# Altium schematic sheet CLKB_clocking_system.SchDoc
size A3
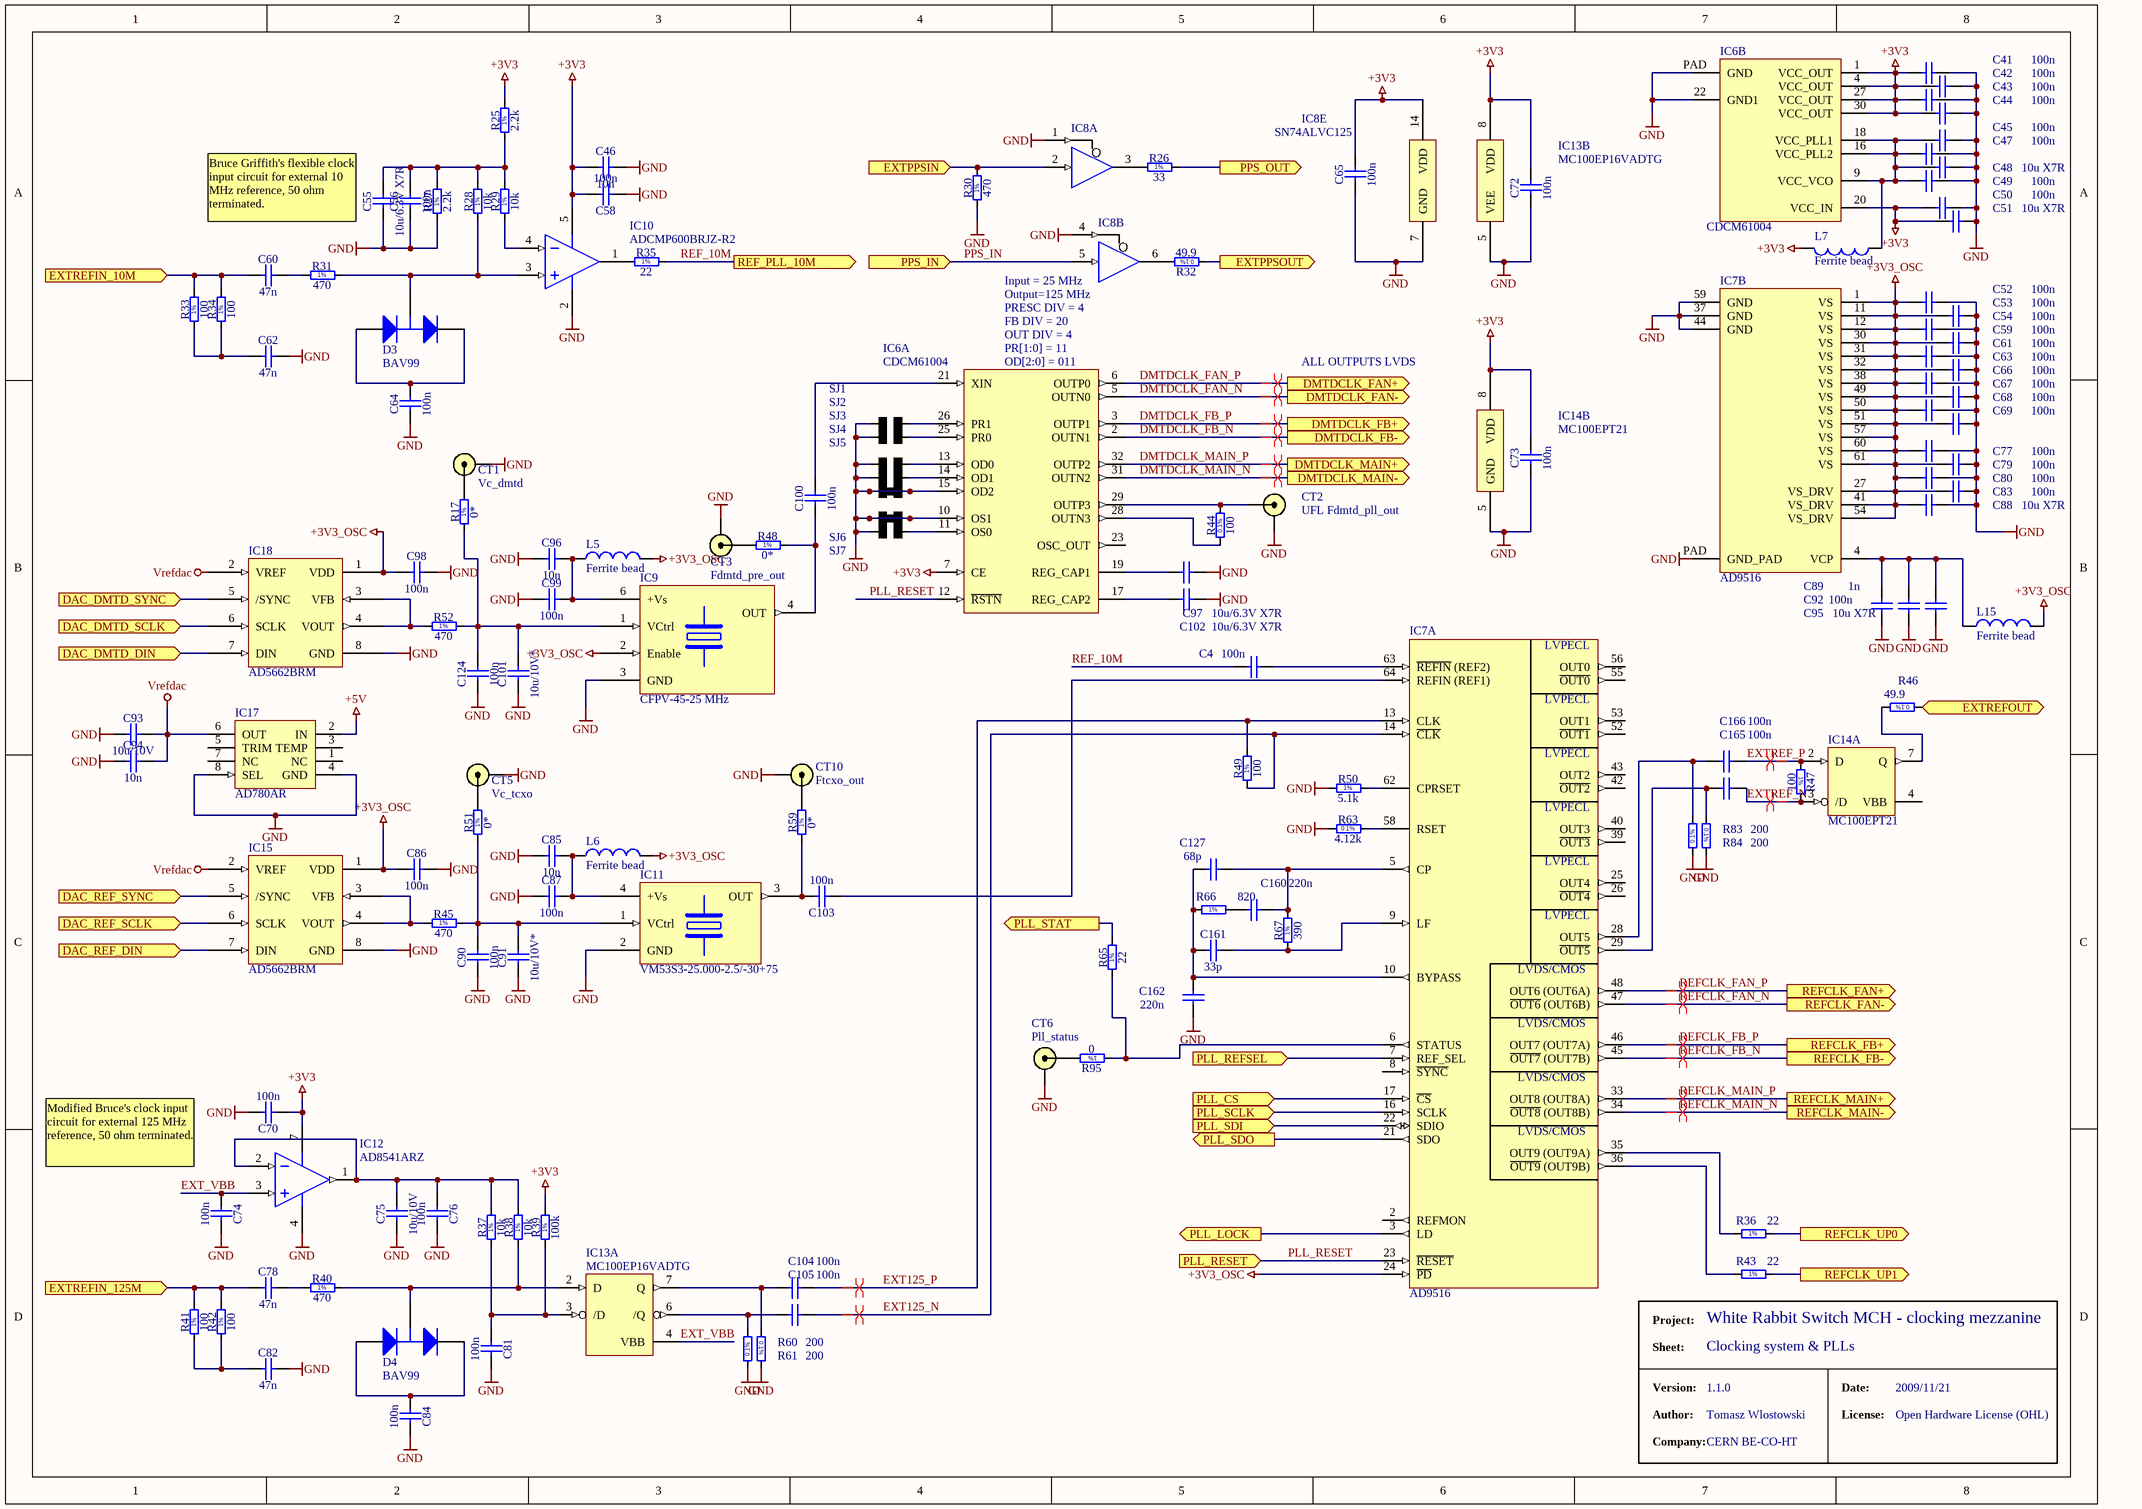
[diagram p0: CLKB_clocking_system.SchDoc]

## Parts
C4  100n  [CAPC1608X87N]
C41  100n  [CAPC1005X55N]
C42  100n  [CAPC1005X55N]
C43  100n  [CAPC1005X55N]
C44  100n  [CAPC1005X55N]
C45  100n  [CAPC1005X55N]
C46  10n  [CAPC1608X87N]
C47  100n  [CAPC1005X55N]
C48  10u X7R  [CAPC1608X87N]
C49  100n  [CAPC1005X55N]
C50  100n  [CAPC1005X55N]
C51  10u X7R  [CAPC1608X87N]
C52  100n  [CAPC1005X55N]
C53  100n  [CAPC1005X55N]
C54  100n  [CAPC1005X55N]
C55  10u/6.3V X7R  [CAPC3216X140N]
C56  100n  [CAPC1608X87N]
C58  100n  [CAPC1608X87N]
C59  100n  [CAPC1005X55N]
C60  47n  [CAPC1608X87N]
C61  100n  [CAPC1005X55N]
C62  47n  [CAPC1608X87N]
C63  100n  [CAPC1005X55N]
C64  100n  [CAPC1608X87N]
C65  100n  [CAPC1608X87N]
C66  100n  [CAPC1005X55N]
C67  100n  [CAPC1005X55N]
C68  100n  [CAPC1005X55N]
C69  100n  [CAPC1005X55N]
C70  100n  [CAPC1608X87N]
C72  100n  [CAPC1608X87N]
C73  100n  [CAPC1608X87N]
C74  100n  [CAPC1608X87N]
C75  10u/10V  [CAPC3216X140N]
C76  100n  [CAPC1608X87N]
C77  100n  [CAPC1005X55N]
C78  47n  [CAPC1608X87N]
C79  100n  [CAPC1005X55N]
C80  100n  [CAPC1005X55N]
C81  100n  [CAPC1608X87N]
C82  47n  [CAPC1608X87N]
C83  100n  [CAPC1005X55N]
C84  100n  [CAPC1608X87N]
C85  10n  [CAPC1608X87N]
C86  100n  [CAPC1608X87N]
C87  100n  [CAPC1608X87N]
C88  10u X7R  [CAPC1608X87N]
C89  1n  [CAPC1005X55N]
C90  100n  [CAPC1608X87N]
C91  10u/10V*  [CAPC3216X140N]
C92  100n  [CAPC1005X55N]
C93  10u/10V  [CAPC3216X140N]
C94  10n  [CAPC1608X87N]
C95  10u X7R  [CAPC1608X87N]
C96  10n  [CAPC1608X87N]
C97  10u/6.3V X7R  [CAPC1608X87N]
C98  100n  [CAPC1608X87N]
C99  100n  [CAPC1608X87N]
C100  100n  [CAPC1608X87N]
C101  10u/10V*  [CAPC3216X140N]
C102  10u/6.3V X7R  [CAPC1608X87N]
C103  100n  [CAPC1608X87N]
C104  100n  [CAPC1005X55N]
C105  100n  [CAPC1005X55N]
C124  100n  [CAPC1608X87N]
C127  68p  [CAPC1608X87N]
C160  220n  [CAPC1608X87N]
C161  33p  [CAPC1608X87N]
C162  220n  [CAPC1608X87N]
C165  100n  [CAPC1005X55N]
C166  100n  [CAPC1005X55N]
CT1  Vc_dmtd  [CON_UFL_HIROSE_RECEPTACLE]
CT2  UFL Fdmtd_pll_out  [CON_UFL_HIROSE_RECEPTACLE]
CT3  Fdmtd_pre_out  [CON_UFL_HIROSE_RECEPTACLE]
CT5  Vc_tcxo  [CON_UFL_HIROSE_RECEPTACLE]
CT6  Pll_status  [CON_UFL_HIROSE_RECEPTACLE]
CT10  Ftcxo_out  [CON_UFL_HIROSE_RECEPTACLE]
D3  BAV99  [SOT-23]
D4  BAV99  [SOT-23]
IC6  CDCM61004  [QFN32_POWERPAD]  (parts A,B of 2)
IC7  AD9516  [QFN50P900X900X100-64M]  (parts A,B of 2)
IC8  SN74ALVC125  [SO-14]  (value not drawn)  (parts A,B,E of 5)
IC9  CFPV-45-25 MHz  [vs-705]
IC10  value ADCMP600BRJZ-R2  [SOT23-5AL]  (hidden comment: ADCMP600)
IC11  VM53S3-25.000-2.5/-30+75  [VCTCXO_VM53S]
IC12  value AD8541ARZ  [SOIC127P600-8AL]  (hidden comment: AD8541)
IC13  value MC100EP16VADTG  [TSOP65P490-8AN]  (hidden comment: MC100EP16)  (parts A,B of 2)
IC14  MC100EPT21  [TSOP65P490-8AN]  (parts A,B of 2)
IC15  value AD5662BRM  [TSOP65P490-8AN]  (hidden comment: AD5662B)
IC17  AD780AR  [R-8C_M]
IC18  value AD5662BRM  [TSOP65P490-8AN]  (hidden comment: AD5662B)
L5  Ferrite bead  [INDC2012-0805]
L6  Ferrite bead  [INDC2012-0805]
L7  Ferrite bead  [INDC1608-0603]
L15  Ferrite bead  [INDC1608-0603]
R17  0*  [RESC1608X55N]
R25  2.2k  [RESC1608X55N]
R26  33  [RESC1608X55N]
R27  2.2k  [RESC1608X55N]
R28  10k  [RESC1608X55N]
R29  10k  [RESC1608X55N]
R30  470  [RESC1608X55N]
R31  470  [RESC1608X55N]
R32  49.9  [RESC1608X55N]
R33  100  [RESC1608X55N]
R34  100  [RESC1608X55N]
R35  22  [RESC1608X55N]
R36  22  [RESC1608X55N]
R37  10k  [RESC1608X55N]
R38  10k  [RESC1608X55N]
R39  100k  [RESC1608X55N]
R40  470  [RESC1608X55N]
R41  100  [RESC1608X55N]
R42  100  [RESC1608X55N]
R43  22  [RESC1608X55N]
R44  100  [RESC1608X55N]
R45  470  [RESC1608X55N]
R46  49.9  [RESC1608X55N]
R47  100  [RESC1608X55N]
R48  0*  [RESC1608X55N]
R49  100  [RESC1608X55N]
R50  5.1k  [RESC1608X55N]
R51  0*  [RESC1608X55N]
R52  470  [RESC1608X55N]
R59  0*  [RESC1608X55N]
R60  200  [RESC1608X55N]
R61  200  [RESC1608X55N]
R63  4.12k  [RESC1608X55N]
R65  22  [RESC1608X55N]
R66  820  [RESC1608X55N]
R67  390  [RESC1608X55N]
R83  200  [RESC1608X55N]
R84  200  [RESC1608X55N]
R95  0  [RESC1608X55N]
SJ1  Solder joint (open)  [SJOINT_norm_open]  (value not drawn)
SJ2  Solder joint (open)  [SJOINT_norm_open]  (value not drawn)
SJ3  Solder joint (open)  [SJOINT_norm_open]  (value not drawn)
SJ4  Solder joint (open)  [SJOINT_norm_open]  (value not drawn)
SJ5  Solder joint (closed)  [SJOINT_norm_short]  (value not drawn)
SJ6  Solder joint (closed)  [SJOINT_norm_short]  (value not drawn)
SJ7  Solder joint (open)  [SJOINT_norm_open]  (value not drawn)

## Ports
DAC_DMTD_DIN (in), DAC_DMTD_SCLK (in), DAC_DMTD_SYNC (in), DAC_REF_DIN (in), DAC_REF_SCLK (in), DAC_REF_SYNC (in), DMTDCLK_FAN+ (out), DMTDCLK_FAN- (out), DMTDCLK_FB+ (out), DMTDCLK_FB- (out), DMTDCLK_MAIN+ (out), DMTDCLK_MAIN- (out), EXTPPSIN (in), EXTPPSOUT (out), EXTREFIN_10M (in), EXTREFIN_125M (in), EXTREFOUT (in), PLL_CS (in), PLL_LOCK (out), PLL_REFSEL (in), PLL_RESET (in), PLL_SCLK (in), PLL_SDI (in), PLL_SDO (out), PLL_STAT (out), PPS_IN (in), PPS_OUT (out), REF_PLL_10M (out), REFCLK_FAN+ (out), REFCLK_FAN- (out), REFCLK_FB+ (out), REFCLK_FB- (out), REFCLK_MAIN+ (out), REFCLK_MAIN- (out), REFCLK_UP0 (out), REFCLK_UP1 (out)

## Nets
+3V3: C41.1 C42.1 C43.1 C44.1 C46.1 C50.1 C51.1 C58.2 C65.2 C70.1 C72.2 C73.2 IC6.1(VCC_OUT) IC6.4(VCC_OUT) IC6.7(CE) IC6.20(VCC_IN) IC6.27(VCC_OUT) IC6.30(VCC_OUT) IC8.14(VDD) IC10.5(VCC/VCCO) IC12.7(V+) IC13.8(VDD) IC14.8(VDD) L7.2 R25.2 R39.2
+3V3_OSC: C52.1 C53.1 C54.1 C59.1 C61.1 C63.1 C66.1 C67.1 C68.1 C69.1 C77.1 C79.1 C80.1 C83.1 C86.1 C88.1 C98.1 IC7.1(VS) IC7.11(VS) IC7.12(VS) IC7.24(~{PD}) IC7.27(VS_DRV) IC7.30(VS) IC7.31(VS) IC7.32(VS) IC7.38(VS) IC7.41(VS_DRV) IC7.49(VS) IC7.50(VS) IC7.51(VS) IC7.54(VS_DRV) IC7.57(VS) IC7.60(VS) IC7.61(VS) IC9.2(Enable) IC15.1(VDD) IC18.1(VDD) L5.2 L6.2 L15.2
+5V: IC17.2(IN)
GND: C41.2 C42.2 C43.2 C44.2 C45.2 C46.2 C47.2 C48.2 C49.2 C50.2 C51.2 C52.2 C53.2 C54.2 C55.1 C56.1 C58.1 C59.2 C61.2 C62.2 C63.2 C64.1 C65.1 C66.2 C67.2 C68.2 C69.2 C70.2 C72.1 C73.1 C74.2 C75.1 C76.2 C77.2 C79.2 C80.2 C81.2 C82.2 C83.2 C84.2 C85.1 C86.2 C87.1 C88.2 C89.1 C90.1 C91.1 C92.1 C93.1 C94.1 C95.1 C96.1 C97.2 C98.2 C99.1 C101.1 C102.2 C124.1 C162.1 CT1.2 CT2.2 CT3.2 CT5.2 CT6.2 CT10.2 IC6.10(OS1) IC6.15(OD2) IC6.22(GND1) IC6.PAD(GND) IC7.37(GND) IC7.44(GND) IC7.59(GND) IC7.PAD(GND_PAD) IC8.1(~{A}) IC8.4(~{A}) IC8.7(GND) IC9.3(GND) IC10.2(VEE) IC11.2(GND) IC12.4(V-) IC13.5(VEE) IC14.5(GND) IC15.8(GND) IC17.4(GND) IC17.8(SEL) IC18.8(GND) R27.1 R30.1 R50.1 R60.2 R61.1 R63.1 R83.2 R84.1 SJ1.1(P1) SJ2.1(P1) SJ3.1(P1) SJ4.1(P1) SJ5.1(P1) SJ5.2(P2) SJ6.1(P1) SJ6.2(P2) SJ7.1(P1)
Vrefdac: C93.2 C94.2 IC15.2(VREF) IC17.6(OUT) IC18.2(VREF)
DAC_DMTD_DIN: IC18.7(DIN) ; port DAC_DMTD_DIN
DAC_DMTD_SCLK: IC18.6(SCLK) ; port DAC_DMTD_SCLK
DAC_DMTD_SYNC: IC18.5(/SYNC) ; port DAC_DMTD_SYNC
DAC_REF_DIN: IC15.7(DIN) ; port DAC_REF_DIN
DAC_REF_SCLK: IC15.6(SCLK) ; port DAC_REF_SCLK
DAC_REF_SYNC: IC15.5(/SYNC) ; port DAC_REF_SYNC
DMTDCLK_FAN_N: IC6.5(OUTN0) ; port DMTDCLK_FAN-
DMTDCLK_FAN_P: IC6.6(OUTP0) ; port DMTDCLK_FAN+
DMTDCLK_FB_N: IC6.2(OUTN1) ; port DMTDCLK_FB-
DMTDCLK_FB_P: IC6.3(OUTP1) ; port DMTDCLK_FB+
DMTDCLK_MAIN_N: IC6.31(OUTN2) ; port DMTDCLK_MAIN-
DMTDCLK_MAIN_P: IC6.32(OUTP2) ; port DMTDCLK_MAIN+
EXT125_N: C105.2 IC7.14(~{CLK}) R49.1
EXT125_P: C104.2 IC7.13(CLK) R49.2
EXT_VBB: C74.1 IC12.3(IN+) IC13.4(VBB)
EXTPPSIN: IC8.2(B) R30.2 ; port EXTPPSIN
EXTPPSOUT: R32.1 ; port EXTPPSOUT
EXTREF_N: C165.2 IC14.3(/D) R47.2
EXTREF_P: C166.2 IC14.2(D) R47.1
EXTREFIN_10M: C60.1 R33.2 R34.2 ; port EXTREFIN_10M
EXTREFIN_125M: C78.1 R41.2 R42.2 ; port EXTREFIN_125M
EXTREFOUT: R46.1 ; port EXTREFOUT
PLL_CS: IC7.17(~{CS}) ; port PLL_CS
PLL_LOCK: IC7.3(LD) ; port PLL_LOCK
PLL_REFSEL: IC7.7(REF_SEL) ; port PLL_REFSEL
PLL_RESET: IC6.12(~{RSTN}) IC7.23(~{RESET}) ; port PLL_RESET
PLL_SCLK: IC7.16(SCLK) ; port PLL_SCLK
PLL_SDI: IC7.22(SDIO) ; port PLL_SDI
PLL_SDO: IC7.21(SDO) ; port PLL_SDO
PLL_STAT: R65.2 ; port PLL_STAT
PPS_IN: IC8.5(B) ; port PPS_IN
PPS_OUT: R26.2 ; port PPS_OUT
REF_10M: C4.2 R35.2 ; port REF_PLL_10M
REFCLK_FAN_N: IC7.47(~{OUT6}_(OUT6B)) ; port REFCLK_FAN-
REFCLK_FAN_P: IC7.48(OUT6_(OUT6A)) ; port REFCLK_FAN+
REFCLK_FB_N: IC7.45(~{OUT7}_(OUT7B)) ; port REFCLK_FB-
REFCLK_FB_P: IC7.46(OUT7_(OUT7A)) ; port REFCLK_FB+
REFCLK_MAIN_N: IC7.34(~{OUT8}_(OUT8B)) ; port REFCLK_MAIN-
REFCLK_MAIN_P: IC7.33(OUT8_(OUT8A)) ; port REFCLK_MAIN+
REFCLK_UP0: R36.2 ; port REFCLK_UP0
REFCLK_UP1: R43.2 ; port REFCLK_UP1
NetC4_1: C4.1 IC7.63(~{REFIN}_(REF2))
NetC45_1: C45.1 C47.1 C48.1 C49.1 IC6.9(VCC_VCO) IC6.16(VCC_PLL2) IC6.18(VCC_PLL1) L7.1
NetC55_2: C55.2 C56.2 R25.1 R27.2 R28.2 R29.2
NetC60_2: C60.2 R31.1
NetC62_1: C62.1 R33.1 R34.1
NetC64_2: C64.2 D3.1(A) D3.2(K)
NetC75_2: C75.2 C76.1 IC12.1(OUT) IC12.2(IN-) R37.2 R38.2
NetC78_2: C78.2 R40.1
NetC81_1: C81.1 IC13.3(/D) R37.1 R39.1
NetC82_1: C82.1 R41.1 R42.1
NetC84_1: C84.1 D4.1(A) D4.2(K)
NetC85_2: C85.2 C87.2 IC11.4(+Vs) L6.1
NetC89_2: C89.2 C92.2 C95.2 IC7.4(VCP) L15.1
NetC90_2: C90.2 C91.2 IC11.1(VCtrl) R45.2 R51.1
NetC96_2: C96.2 C99.2 IC9.6(+Vs) L5.1
NetC97_1: C97.1 IC6.19(REG_CAP1)
NetC100_1: C100.1 IC9.4(OUT) R48.2
NetC100_2: C100.2 IC6.21(XIN)
NetC101_2: C101.2 C124.2 IC9.1(VCtrl) R17.1 R52.2
NetC102_1: C102.1 IC6.17(REG_CAP2)
NetC103_1: C103.1 IC7.64(REFIN_(REF1))
NetC103_2: C103.2 IC11.3(OUT) R59.1
NetC104_1: C104.1 IC13.7(Q) R60.1
NetC105_1: C105.1 IC13.6(/Q) R61.2
NetC127_1: C127.1 C161.1 C162.2 IC7.10(BYPASS) R66.1
NetC127_2: C127.2 C160.2 IC7.5(CP) R67.2
NetC160_1: C160.1 R66.2
NetC161_2: C161.2 IC7.9(LF) R67.1
NetC165_1: C165.1 IC7.29(~{OUT5}) R83.1
NetC166_1: C166.1 IC7.28(OUT5) R84.2
NetCT1_1: CT1.1 R17.2
NetCT2_1: CT2.1 IC6.29(OUTP3) R44.2
NetCT3_1: CT3.1 R48.1
NetCT5_1: CT5.1 R51.2
NetCT6_1: CT6.1 R95.2
NetCT10_1: CT10.1 R59.2
NetD3_3: D3.3(C) IC10.3(VP) R28.1 R31.2
NetD4_3: D4.3(C) IC13.2(D) R38.1 R40.2
NetIC6_11: IC6.11(OS0) SJ7.2(P2)
NetIC6_13: IC6.13(OD0) SJ3.2(P2)
NetIC6_14: IC6.14(OD1) SJ4.2(P2)
NetIC6_25: IC6.25(PR0) SJ2.2(P2)
NetIC6_26: IC6.26(PR1) SJ1.2(P2)
NetIC6_28: IC6.28(OUTN3) R44.1
NetIC7_6: IC7.6(STATUS) R65.1 R95.1
NetIC7_35: IC7.35(OUT9_(OUT9A)) R36.1
NetIC7_36: IC7.36(~{OUT9}_(OUT9B)) R43.1
NetIC7_58: IC7.58(RSET) R63.2
NetIC7_62: IC7.62(CPRSET) R50.2
NetIC8_3: IC8.3(Y) R26.1
NetIC8_6: IC8.6(Y) R32.2
NetIC10_1: IC10.1(Q) R35.1
NetIC10_4: IC10.4(VN) R29.1
NetIC14_7: IC14.7(Q) R46.2
NetIC15_3: IC15.3(VFB) IC15.4(VOUT) R45.1
NetIC18_3: IC18.3(VFB) IC18.4(VOUT) R52.1

Not connected (* = marked no-connect by the designer): IC6 23(OSC_OUT); IC7 2(REFMON) 8(~{SYNC}) 25(OUT4) 26(~{OUT4}) 39(~{OUT3}) 40(OUT3) 42(~{OUT2}) 43(OUT2) 52(~{OUT1}) 53(OUT1) 55(~{OUT0}) 56(OUT0); IC14 4(VBB); IC17 1(NC) 3(TEMP) 5(TRIM) 7(NC)

## Layout directives
differential pair: DMTDCLK_FAN_N, DMTDCLK_FAN_P, DMTDCLK_FB_N, DMTDCLK_FB_P, DMTDCLK_MAIN_N, DMTDCLK_MAIN_P, EXT125_N, EXT125_P, EXTREF_N, EXTREF_P, REFCLK_FAN_N, REFCLK_FAN_P, REFCLK_FB_N, REFCLK_FB_P, REFCLK_MAIN_N, REFCLK_MAIN_P

## Notes on the sheet
- (near C55) Bruce Griffith's flexible clock input circuit for external 10 MHz reference, 50 ohm terminated.
- (near IC8) Output=125 MHz
- (near IC8) Input = 25 MHz
- PRESC DIV = 4
- FB DIV = 20
- (near IC6) OUT DIV = 4
- (near IC6) PR[1:0] = 11
- (near IC6) OD[2:0] = 011
- ALL OUTPUTS LVDS
- Modified Bruce's clock input circuit for external 125 MHz reference, 50 ohm terminated.
- Project:
- (near R43) White Rabbit Switch MCH - clocking mezzanine
- Sheet:
- Version:
- Clocking system & PLLs
- 1.1.0
- Date:
- 2009/11/21
- Author:
- Company:
- Tomasz Wlostowski
- CERN BE-CO-HT
- License:
- Open Hardware License (OHL)
- (in symbol AD9516, part A) LVPECL; LVDS/CMOS
- (in symbol R0603_0R_JUMPER) 1%
- (in symbol R0603_2K2_1%_0.1W_100PPM) 1%
- (in symbol R0603_4K12_0.1%_0.063W_10PPM) 0.1%
- (in symbol R0603_5K1_1%_0.1W_100PPM) 1%
- (in symbol R0603_10K_1%_0.1W_100PPM) 1%
- (in symbol R0603_22R_1%_0.1W_100PPM) 1%
- (in symbol R0603_33R_1%_0.1W_100PPM) 1%
- (in symbol R0603_49R9_0.1%_0.063W_10PPM) 0.1%
- (in symbol R0603_100K_1%_0.1W_100PPM) 1%
- (in symbol R0603_100R_0.1%_0.063W_10PPM) 0.1%
- (in symbol R0603_100R_1%_0.1W_100PPM) 1%
- (in symbol R0603_200R_0.1%_0.063W_10PPM) 0.1%
- (in symbol R0603_390R_1%_0.1W_100PPM) 1%
- (in symbol R0603_470R_1%_0.1W_100PPM) 1%
- (in symbol R0603_820R_1%_0.1W_100PPM) 1%

## Library data of the parts
C4 C56 C58 C64 C65 C70 C72-C74 C76 C81 C84 C86 C87 C90 C98-C100 C103 C124 = CC0603_100NF_50V_10%_X7R: Non-polarised capacitor; Part Description: SMD Multilayer Chip Ceramic Capacitor; Manufacturer: GENERIC; Manufacturer1 Part Number: 223858615649; Manufacturer1 Datasheet: \\cern.ch\dfs\Applications\Altium\Datasheets\CC0603_X7R_PHYCOMP.pdf; Value: 100nF; Voltage: 50V; TC: X7R; Tolerance: ±10%; Table: Capacitors SMD; Part Number: CC0603_100NF_50V_10%_X7R; Component Kind: Standard; Component Type: Standard; Designator: Capacitor - non polarized; Library Reference: Capacitor - non polarized; Pin Count: 2; Status: Preferred; Manufacturer Part Number: CC0603_100NF_50V_10%_X7R; Case: 0603; Mounted: Yes; Socket: No; SMD: Yes; Manufacturer1 Example: PHYCOMP; Manufacturer1 ComponentHeight: 0.87mm; HelpURL: \\cern.ch\dfs\Applications\Altium\Datasheets\CC0603_X7R_PHYCOMP.pdf; Author: CERN DEM JLC; CreateDate: 12/3/2007; LatestRevisionDate: 12/3/2007
C41-C45 C47 C49 C50 C52-C54 C59 C61 C63 C66-C69 C77 C79 C80 C83 C92 C104 C105 C165 C166 = CC0402_100NF_16V_10%_X7R: Non-polarised capacitor; Part Description: SMD Multilayer Chip Ceramic Capacitor; Manufacturer: GENERIC; Manufacturer1 Part Number: 223878715649; Manufacturer1 Datasheet: \\cern.ch\dfs\Applications\Altium\Datasheets\CC0402_X7R_PHYCOMP.pdf; Value: 100nF; Voltage: 16V; TC: X7R; Tolerance: ±10%; Table: Capacitors SMD; Part Number: CC0402_100NF_16V_10%_X7R; Component Kind: Standard; Component Type: Standard; Designator: Capacitor - non polarized; Library Reference: Capacitor - non polarized; Pin Count: 2; Status: Not Recommended; Manufacturer Part Number: CC0402_100NF_16V_10%_X7R; Case: 0402; Mounted: Yes; Socket: No; SMD: Yes; Manufacturer1 Example: PHYCOMP; Manufacturer1 ComponentHeight: 0.55mm; HelpURL: \\cern.ch\dfs\Applications\Altium\Datasheets\CC0402_X7R_PHYCOMP.pdf; Author: CERN DEM JLC; CreateDate: 2007-12-03; LatestRevisionDate: 2007-12-03
C46 C85 C94 C96 = CC0603_10NF_50V_10%_X7R: Non-polarised capacitor; Part Description: SMD Multilayer Chip Ceramic Capacitor; Manufacturer: GENERIC; Manufacturer1 Part Number: 223858615636; Manufacturer1 Datasheet: \\cern.ch\dfs\Applications\Altium\Datasheets\CC0603_X7R_PHYCOMP.pdf; Value: 10nF; Voltage: 50V; TC: X7R; Tolerance: ±10%; Table: Capacitors SMD; Part Number: CC0603_10NF_50V_10%_X7R; Component Kind: Standard; Component Type: Standard; Designator: Capacitor - non polarized; Library Reference: Capacitor - non polarized; Pin Count: 2; Status: Preferred; Manufacturer Part Number: CC0603_10NF_50V_10%_X7R; Case: 0603; Mounted: Yes; Socket: No; SMD: Yes; Manufacturer1 Example: PHYCOMP; Manufacturer1 ComponentHeight: 0.87mm; HelpURL: \\cern.ch\dfs\Applications\Altium\Datasheets\CC0603_X7R_PHYCOMP.pdf; Author: CERN DEM JLC; CreateDate: 12/3/2007; LatestRevisionDate: 12/3/2007
C48 C51 C88 C95 C97 C102 = CC0603_10UF_6.3V_20%_X5R: Non-polarised capacitor; Part Description: SMD Multilayer Chip Ceramic Capacitor; Manufacturer: GENERIC; Manufacturer1 Part Number: C0603C106M9PAC; Manufacturer1 Datasheet: \\cern.ch\dfs\Applications\Altium\Datasheets\CC0603_X5R_KEMET.pdf; Value: 10uF; Voltage: 6.3V; TC: X5R; Tolerance: ±20%; Table: Capacitors SMD; Part Number: CC0603_10UF_6.3V_20%_X5R; Component Kind: Standard; Component Type: Standard; Designator: Capacitor - non polarized; Library Reference: Capacitor - non polarized; Pin Count: 2; Status: Preferred; Manufacturer Part Number: CC0603_10uF_6.3V_20%_X5R; Case: 0603; Mounted: Yes; Socket: No; SMD: Yes; Manufacturer1 Example: KEMET; Manufacturer1 ComponentHeight: 0.95mm; HelpURL: \\cern.ch\dfs\Applications\Altium\Datasheets\CC0603_X5R_KEMET.pdf; Author: CERN DEM JLC; CreateDate: 2007-12-03; LatestRevisionDate: 2007-12-03
C55 = CC1206_10UF_10V_10%_X7R: Non-polarised capacitor; Part Description: SMD Multilayer Chip Ceramic Capacitor; Manufacturer: GENERIC; Manufacturer1 Part Number: C1206C106K8RAC; Manufacturer1 Datasheet: \\cern.ch\dfs\Applications\Altium\Datasheets\CC1206_X7R_KEMET.pdf; Value: 10uF; Voltage: 10V; Tolerance: ±10%; Table: Capacitors SMD; Part Number: CC1206_10UF_10V_10%_X7R; Component Kind: Standard; Component Type: Standard; Designator: Capacitor - non polarized; Library Reference: Capacitor - non polarized; Pin Count: 2; Status: Preferred; TC: X7R; Manufacturer Part Number: CC1206_10uF_10V_10%_X7R; Case: 1206; Mounted: Yes; Socket: No; SMD: Yes; Manufacturer1 Example: KEMET; Manufacturer1 ComponentHeight: 1.8mm; HelpURL: \\cern.ch\dfs\Applications\Altium\Datasheets\CC1206_X7R_KEMET.pdf; Author: CERN DEM JLC; CreateDate: 12/3/2007; LatestRevisionDate: 12/3/2007
C60 C62 C78 C82 = CC0603_47NF_25V_10%_X7R: Non-polarised capacitor; Part Description: SMD Multilayer Chip Ceramic Capacitor; Manufacturer: GENERIC; Manufacturer1 Part Number: 223891615645; Manufacturer1 Datasheet: \\cern.ch\dfs\Applications\Altium\Datasheets\CC0603_X7R_PHYCOMP.pdf; Value: 47nF; Voltage: 25V; TC: X7R; Tolerance: ±10%; Table: Capacitors SMD; Part Number: CC0603_47NF_25V_10%_X7R; Component Kind: Standard; Component Type: Standard; Designator: Capacitor - non polarized; Library Reference: Capacitor - non polarized; Pin Count: 2; Status: Preferred; Manufacturer Part Number: CC0603_47NF_25V_10%_X7R; Case: 0603; Mounted: Yes; Socket: No; SMD: Yes; Manufacturer1 Example: PHYCOMP; Manufacturer1 ComponentHeight: 0.87mm; HelpURL: \\cern.ch\dfs\Applications\Altium\Datasheets\CC0603_X7R_PHYCOMP.pdf; Author: CERN DEM JLC; CreateDate: 12/3/2007; LatestRevisionDate: 12/3/2007
C75 C91 C93 C101 = CC1206_10UF_10V_10%_X7R: Non-polarised capacitor; Part Description: SMD Multilayer Chip Ceramic Capacitor; Manufacturer: GENERIC; Manufacturer1 Part Number: C1206C106K8RAC; Manufacturer1 Datasheet: \\cern.ch\dfs\Applications\Altium\Datasheets\CC1206_X7R_KEMET.pdf; Value: 10uF; Voltage: 10V; TC: X7R; Tolerance: ±10%; Table: Capacitors SMD; Part Number: CC1206_10UF_10V_10%_X7R; Component Kind: Standard; Component Type: Standard; Designator: Capacitor - non polarized; Library Reference: Capacitor - non polarized; Pin Count: 2; Status: Preferred; Manufacturer Part Number: CC1206_10uF_10V_10%_X7R; Case: 1206; Mounted: Yes; Socket: No; SMD: Yes; Manufacturer1 Example: KEMET; Manufacturer1 ComponentHeight: 1.8mm; HelpURL: \\cern.ch\dfs\Applications\Altium\Datasheets\CC1206_X7R_KEMET.pdf; Author: CERN DEM JLC; CreateDate: 12/3/2007; LatestRevisionDate: 12/3/2007
C89 = CC0402_1NF_50V_10%_X7R: Non-polarised capacitor; Part Description: SMD Multilayer Chip Ceramic Capacitor; Manufacturer: GENERIC; Manufacturer1 Part Number: 223858715623; Manufacturer1 Datasheet: \\cern.ch\dfs\Applications\Altium\Datasheets\CC0402_X7R_PHYCOMP.pdf; Value: 1nF; Voltage: 50V; TC: X7R; Tolerance: ±10%; Table: Capacitors SMD; Part Number: CC0402_1NF_50V_10%_X7R; Component Kind: Standard; Component Type: Standard; Designator: Capacitor - non polarized; Library Reference: Capacitor - non polarized; Pin Count: 2; Status: Not Recommended; Manufacturer Part Number: CC0402_1NF_50V_10%_X7R; Case: 0402; Mounted: Yes; Socket: No; SMD: Yes; Manufacturer1 Example: PHYCOMP; Manufacturer1 ComponentHeight: 0.55mm; HelpURL: \\cern.ch\dfs\Applications\Altium\Datasheets\CC0402_X7R_PHYCOMP.pdf; Author: CERN DEM JLC; CreateDate: 2007-12-03; LatestRevisionDate: 2007-12-03
C127 = CC0603_68PF_50V_5%_NP0: Non-polarised capacitor; Part Description: SMD Multilayer Chip Ceramic Capacitor; Manufacturer: GENERIC; Manufacturer1 Part Number: 223886715689; Manufacturer1 Datasheet: \\cern.ch\dfs\Applications\Altium\Datasheets\CC0603_NP0_PHYCOMP.pdf; Value: 68pF; Voltage: 50V; TC: NP0; Tolerance: ±5%; Table: Capacitors SMD; Part Number: CC0603_68PF_50V_5%_NP0; Component Kind: Standard; Component Type: Standard; Designator: Capacitor - non polarized; Library Reference: Capacitor - non polarized; Pin Count: 2; Status: Preferred; Manufacturer Part Number: CC0603_68PF_50V_5%_NP0; Case: 0603; Mounted: Yes; Socket: No; SMD: Yes; Manufacturer1 Example: PHYCOMP; Manufacturer1 ComponentHeight: 0.87mm; HelpURL: \\cern.ch\dfs\Applications\Altium\Datasheets\CC0603_NP0_PHYCOMP.pdf; Author: CERN DEM JLC; CreateDate: 2007-12-03; LatestRevisionDate: 2007-12-03
C160 C162 = CC0603_220NF_16V_+80%-20%_Y5V: Non-polarised capacitor; Part Description: SMD Multilayer Chip Ceramic Capacitor; Manufacturer: GENERIC; Manufacturer1 Part Number: 223878619854; Manufacturer1 Datasheet: \\cern.ch\dfs\Applications\Altium\Datasheets\CC0603_Y5V_PHYCOMP.pdf; Value: 220nF; Voltage: 16V; TC: Y5V; Table: Capacitors SMD; Part Number: CC0603_220NF_16V_+80%-20%_Y5V; Component Kind: Standard; Component Type: Standard; Designator: Capacitor - non polarized; Library Reference: Capacitor - non polarized; Pin Count: 2; Status: Preferred; Tolerance: +80% -20%; Manufacturer Part Number: CC0603_220NF_16V_+80%-20%_Y5V; Case: 0603; Mounted: Yes; Socket: No; SMD: Yes; Manufacturer1 Example: PHYCOMP; Manufacturer1 ComponentHeight: 0.87mm; HelpURL: \\cern.ch\dfs\Applications\Altium\Datasheets\CC0603_Y5V_PHYCOMP.pdf; Author: CERN DEM JLC; CreateDate: 2007-12-03; LatestRevisionDate: 2007-12-03
C161 = CC0603_33PF_50V_5%_NP0: Non-polarised capacitor; Part Description: SMD Multilayer Chip Ceramic Capacitor; Manufacturer: GENERIC; Manufacturer1 Part Number: 223886715339; Manufacturer1 Datasheet: \\cern.ch\dfs\Applications\Altium\Datasheets\CC0603_NP0_PHYCOMP.pdf; Value: 33pF; Voltage: 50V; TC: NP0; Tolerance: ±5%; Table: Capacitors SMD; Part Number: CC0603_33PF_50V_5%_NP0; Component Kind: Standard; Component Type: Standard; Designator: Capacitor - non polarized; Library Reference: Capacitor - non polarized; Pin Count: 2; Status: Preferred; Manufacturer Part Number: CC0603_33PF_50V_5%_NP0; Case: 0603; Mounted: Yes; Socket: No; SMD: Yes; Manufacturer1 Example: PHYCOMP; Manufacturer1 ComponentHeight: 0.87mm; HelpURL: \\cern.ch\dfs\Applications\Altium\Datasheets\CC0603_NP0_PHYCOMP.pdf; Author: CERN DEM JLC; CreateDate: 2007-12-03; LatestRevisionDate: 2007-12-03
CT1-CT3 CT5 CT6 CT10 = CON_TESTPOINT_UFL: UFL connector testpoint
D3 D4 = BAV99: Silicon Switching Diode Array for High-Speed Switching; RefId: 1081211; Published: 21-Mar-2003; DatasheetDocument: Oct-1999; PackageDocument: Sep-2001; PackageReference: SOT-23; Publisher: Altium Limited; ComponentLink1Description: Manufacturer Link; ComponentLink1URL: http://www.infineon.com/; ComponentLink2Description: Datasheet; ComponentLink2URL: http://www.infineon.com/upload/Document/cmc_upload/documents/080/631/bav99series_1.pdf; Supplier: Farnell; Value: BAV99
IC6 = CDCM61004: PLL generator with 1:4 fanout
IC7 = AD9516: PLL with clock fanout
IC8 = SN74ALVC125: Quad Buffer with 3-State Outputs with TTL Compatible Inputs; Value: SN74ALVC125
IC9 = VCXO_CFPV_45: VCXO oscillator
IC10 = ADCMP600: Analog Devices fast comparator; RefId: 1441023; Supplier: Farnell
IC11 = VCTCXO_VM53S: VCTCXO oscillator
IC12 = AD8541: Analog Devices general purpose low-voltage R2R CMOS opamp; RefId: 9603859; Supplier: Farnell
IC13 = MC100EP16: ONSemi differental receiver w/ECL output; RefId: 1607606; Supplier: Farnell
IC14 = MC100EPT21: ONSemi LVDS/LVPECL -> LVTTL/LVCMOS buffer; RefId: MC100EPT21DTGOS-ND; Supplier: Digikey; Value: MC100EPT21
IC15 IC18 = AD5662: Analog Devices 16-bit DAC w/SPI interface, ext ref; RefId: 1117908; Supplier: Farnell
IC17 = AD780AR: 2.5V/3.0V High-Precision Reference; Note: Pins 1 and 7 are not connected; Value: AD780ARZ; RefId: AD780ARZ-ND; Published: 8-Jun-2000; LatestRevisionDate: 13-Apr-2006; LatestRevisionNote: IPC-7351 Footprint Added.; DatasheetVersion: REV. A; PackageVersion: revC; PackageReference: R-8C; Publisher: Altium Limited; PackageDescription: 8-Pin Small Outline Integrated Circuit 1.27 mm Pitch; Code_IPC: SOIC127P600-8; ComponentLink1Description: Manufacturer Link; ComponentLink1URL: http://www.analog.com/en/prod/0,,769_838_AD780%2C00.html; ComponentLink2Description: Datasheet; ComponentLink2URL: http://www.analog.com/UploadedFiles/Data_Sheets/87683462AD780_e.pdf; Supplier: Digikey
L5-L7 L15 = Inductor: Code_IEC: 1005; Published: 8-Jun-2000; LatestRevisionDate: 17-Jul-2002; LatestRevisionNote: Re-released for DXP Platform.; PackageReference: 0402-A; Publisher: Altium Limited; Code_JEITA: 0402
R17 R48 R51 R59 = R0603_0R_JUMPER: Resistor - 1%; Part Description: 1A (0.05R Max DC Resistance) Zero Ohm Jumper; Manufacturer: GENERIC; Manufacturer1 Part Number: NRC06Z0; Manufacturer1 Datasheet: \\cern.ch\dfs\Applications\Altium\Datasheets\R0603_NIC_NRC.pdf; Value: 0; Table: Resistors SMD; Part Number: R0603_0R_JUMPER; Component Kind: Standard; Component Type: Standard; Designator: Resistor - 1%; Library Reference: Resistor - 1%; Pin Count: 2; Status: Preferred; Manufacturer Part Number: R0603_0R_JUMPER; Case: 0603; Mounted: Yes; Socket: No; SMD: Yes; Manufacturer1 Example: NIC COMPONENT; Manufacturer1 ComponentHeight: 0.55mm; HelpURL: \\cern.ch\dfs\Applications\Altium\Datasheets\R0603_NIC_NRC.pdf; Author: CERN DEM JLC; CreateDate: 2007-12-03; LatestRevisionDate: 2008-03-13
R25 R27 = R0603_2K2_1%_0.1W_100PPM: Resistor - 1%; Part Description: General Purpose Thick Film Chip Resistor; Manufacturer: GENERIC; Manufacturer1 Part Number: NRC06F2201TRF; Manufacturer1 Datasheet: \\cern.ch\dfs\Applications\Altium\Datasheets\R0603_NIC_NRC.pdf; Value: 2k2; Power: 0.1W; TC: ±100ppm/°C; Table: Resistors SMD; Part Number: R0603_2K2_1%_0.1W_100PPM; Component Kind: Standard; Component Type: Standard; Designator: Resistor - 1%; Library Reference: Resistor - 1%; Pin Count: 2; Status: Preferred; Tolerance: ±1%; Manufacturer Part Number: R0603_2K2_1%_0.1W_100PPM; Case: 0603; Mounted: Yes; Socket: No; SMD: Yes; Manufacturer1 Example: NIC COMPONENT; Manufacturer1 ComponentHeight: 0.55mm; HelpURL: \\cern.ch\dfs\Applications\Altium\Datasheets\R0603_NIC_NRC.pdf; Author: CERN DEM JLC; CreateDate: 12/3/2007; LatestRevisionDate: 3/13/2008
R26 = R0603_33R_1%_0.1W_100PPM: Resistor - 1%; Part Description: General Purpose Thick Film Chip Resistor; Manufacturer: GENERIC; Manufacturer1 Part Number: NRC06F33R0TRF; Manufacturer1 Datasheet: \\cern.ch\dfs\Applications\Altium\Datasheets\R0603_NIC_NRC.pdf; Power: 0.1W; TC: ±100ppm/°C; Table: Resistors SMD; Part Number: R0603_33R_1%_0.1W_100PPM; Component Kind: Standard; Component Type: Standard; Designator: Resistor - 1%; Library Reference: Resistor - 1%; Pin Count: 2; Value: 33; Status: Preferred; Tolerance: ±1%; Manufacturer Part Number: R0603_33R_1%_0.1W_100PPM; Case: 0603; Mounted: Yes; Socket: No; SMD: Yes; Manufacturer1 Example: NIC COMPONENT; Manufacturer1 ComponentHeight: 0.55mm; HelpURL: \\cern.ch\dfs\Applications\Altium\Datasheets\R0603_NIC_NRC.pdf; Author: CERN DEM JLC; CreateDate: 12/3/2007; LatestRevisionDate: 3/13/2008
R28 R29 R37 R38 = R0603_10K_1%_0.1W_100PPM: Resistor - 1%; Part Description: General Purpose Thick Film Chip Resistor; Manufacturer: GENERIC; Manufacturer1 Part Number: NRC06F1002TRF; Manufacturer1 Datasheet: \\cern.ch\dfs\Applications\Altium\Datasheets\R0603_NIC_NRC.pdf; Power: 0.1W; TC: ±100ppm/°C; Table: Resistors SMD; Part Number: R0603_10K_1%_0.1W_100PPM; Component Kind: Standard; Component Type: Standard; Designator: Resistor - 1%; Library Reference: Resistor - 1%; Pin Count: 2; Value: 10k; Status: Preferred; Tolerance: ±1%; Manufacturer Part Number: R0603_10K_1%_0.1W_100PPM; Case: 0603; Mounted: Yes; Socket: No; SMD: Yes; Manufacturer1 Example: NIC COMPONENT; Manufacturer1 ComponentHeight: 0.55mm; HelpURL: \\cern.ch\dfs\Applications\Altium\Datasheets\R0603_NIC_NRC.pdf; Author: CERN DEM JLC; CreateDate: 12/3/2007; LatestRevisionDate: 3/13/2008
R30 R31 R40 R45 R52 = R0603_470R_1%_0.1W_100PPM: Resistor - 1%; Part Description: General Purpose Thick Film Chip Resistor; Manufacturer: GENERIC; Manufacturer1 Part Number: NRC06F4700TRF; Manufacturer1 Datasheet: \\cern.ch\dfs\Applications\Altium\Datasheets\R0603_NIC_NRC.pdf; Power: 0.1W; TC: ±100ppm/°C; Table: Resistors SMD; Part Number: R0603_470R_1%_0.1W_100PPM; Component Kind: Standard; Component Type: Standard; Designator: Resistor - 1%; Library Reference: Resistor - 1%; Pin Count: 2; Value: 470; Status: Preferred; Tolerance: ±1%; Manufacturer Part Number: R0603_470R_1%_0.1W_100PPM; Case: 0603; Mounted: Yes; Socket: No; SMD: Yes; Manufacturer1 Example: NIC COMPONENT; Manufacturer1 ComponentHeight: 0.55mm; HelpURL: \\cern.ch\dfs\Applications\Altium\Datasheets\R0603_NIC_NRC.pdf; Author: CERN DEM JLC; CreateDate: 12/3/2007; LatestRevisionDate: 3/13/2008
R32 R46 = R0603_49R9_0.1%_0.063W_10PPM: Resistor - 0.1%; Part Description: Thin Film Chip Resistor; Manufacturer: GENERIC; Manufacturer1 Part Number: RN73C1J49R9BTDF; Manufacturer1 Datasheet: \\cern.ch\dfs\Applications\Altium\Datasheets\R0603_Tyco_RN73.pdf; Value: 49R9; Power: 0.063W; TC: ±10ppm; Table: Resistors SMD; Part Number: R0603_49R9_0.1%_0.063W_10PPM; Component Kind: Standard; Component Type: Standard; Designator: Resistor - 0.1%; Library Reference: Resistor - 0.1%; Pin Count: 2; Status: Not recommended; Tolerance: ±0.1%; Manufacturer Part Number: R0603_49R9_0.1%_0.063W_10PPM; Case: 0603; Mounted: Yes; Socket: No; SMD: Yes; Manufacturer1 Example: TYCO HOLSWORTHY; Manufacturer1 ComponentHeight: 0.5mm; HelpURL: \\cern.ch\dfs\Applications\Altium\Datasheets\R0603_Tyco_RN73.pdf; Author: CERN DEM JLC; CreateDate: 12/3/2007; LatestRevisionDate: 3/13/2008
R33 R34 R41 R42 R47 R49 = R0603_100R_1%_0.1W_100PPM: Resistor - 1%; Part Description: General Purpose Thick Film Chip Resistor; Manufacturer: GENERIC; Manufacturer1 Part Number: NRC06F4700TRF; Manufacturer1 Datasheet: \\cern.ch\dfs\Applications\Altium\Datasheets\R0603_NIC_NRC.pdf; Power: 0.1W; TC: ±100ppm/°C; Table: Resistors SMD; Part Number: R0603_100R_1%_0.1W_100PPM; Component Kind: Standard; Component Type: Standard; Designator: Resistor - 1%; Library Reference: Resistor - 1%; Pin Count: 2; Value: 100; Status: Preferred; Tolerance: ±1%; Manufacturer Part Number: R0603_100R_1%_0.1W_100PPM; Case: 0603; Mounted: Yes; Socket: No; SMD: Yes; Manufacturer1 Example: NIC COMPONENT; Manufacturer1 ComponentHeight: 0.55mm; HelpURL: \\cern.ch\dfs\Applications\Altium\Datasheets\R0603_NIC_NRC.pdf; Author: CERN DEM JLC
  R33 R34 R41 R42 R47: CreateDate: 12/3/2007; LatestRevisionDate: 3/13/2008
  R49: CreateDate: 2007-12-03; LatestRevisionDate: 2008-03-13
R35 R36 R43 R65 = R0603_22R_1%_0.1W_100PPM: Resistor - 1%; Part Description: General Purpose Thick Film Chip Resistor; Manufacturer: GENERIC; Manufacturer1 Part Number: NRC06F22R0TRF; Manufacturer1 Datasheet: \\cern.ch\dfs\Applications\Altium\Datasheets\R0603_NIC_NRC.pdf; Power: 0.1W; TC: ±100ppm/°C; Table: Resistors SMD; Part Number: R0603_22R_1%_0.1W_100PPM; Component Kind: Standard; Component Type: Standard; Designator: Resistor - 1%; Library Reference: Resistor - 1%; Pin Count: 2; Value: 22; Status: Preferred; Tolerance: ±1%; Manufacturer Part Number: R0603_22R_1%_0.1W_100PPM; Case: 0603; Mounted: Yes; Socket: No; SMD: Yes; Manufacturer1 Example: NIC COMPONENT; Manufacturer1 ComponentHeight: 0.55mm; HelpURL: \\cern.ch\dfs\Applications\Altium\Datasheets\R0603_NIC_NRC.pdf; Author: CERN DEM JLC; CreateDate: 2007-12-03; LatestRevisionDate: 2008-03-13
R39 = R0603_100K_1%_0.1W_100PPM: Resistor - 1%; Part Description: General Purpose Thick Film Chip Resistor; Manufacturer: GENERIC; Manufacturer1 Part Number: NRC06F1003TRF; Manufacturer1 Datasheet: \\cern.ch\dfs\Applications\Altium\Datasheets\R0603_NIC_NRC.pdf; Power: 0.1W; TC: ±100ppm/°C; Table: Resistors SMD; Part Number: R0603_100K_1%_0.1W_100PPM; Component Kind: Standard; Component Type: Standard; Designator: Resistor - 1%; Library Reference: Resistor - 1%; Pin Count: 2; Value: 100k; Status: Preferred; Tolerance: ±1%; Manufacturer Part Number: R0603_100K_1%_0.1W_100PPM; Case: 0603; Mounted: Yes; Socket: No; SMD: Yes; Manufacturer1 Example: NIC COMPONENT; Manufacturer1 ComponentHeight: 0.55mm; HelpURL: \\cern.ch\dfs\Applications\Altium\Datasheets\R0603_NIC_NRC.pdf; Author: CERN DEM JLC; CreateDate: 12/3/2007; LatestRevisionDate: 3/13/2008
R44 = R0603_100R_0.1%_0.063W_10PPM: Resistor - 0.1%; Part Description: Thin Film Chip Resistor; Manufacturer: GENERIC; Manufacturer1 Part Number: RN73C1J100RBTDF; Manufacturer1 Datasheet: \\cern.ch\dfs\Applications\Altium\Datasheets\R0603_Tyco_RN73.pdf; Power: 0.063W; TC: ±10ppm; Table: Resistors SMD; Part Number: R0603_100R_0.1%_0.063W_10PPM; Component Kind: Standard; Component Type: Standard; Designator: Resistor - 0.1%; Library Reference: Resistor - 0.1%; Pin Count: 2; Value: 100; Status: Not recommended; Tolerance: ±0.1%; Manufacturer Part Number: R0603_100R_0.1%_0.063W_10PPM; Case: 0603; Mounted: Yes; Socket: No; SMD: Yes; Manufacturer1 Example: TYCO HOLSWORTHY; Manufacturer1 ComponentHeight: 0.5mm; HelpURL: \\cern.ch\dfs\Applications\Altium\Datasheets\R0603_Tyco_RN73.pdf; Author: CERN DEM JLC; CreateDate: 2007-12-03; LatestRevisionDate: 2008-03-13
R50 = R0603_5K1_1%_0.1W_100PPM: Resistor - 1%; Part Description: General Purpose Thick Film Chip Resistor; Manufacturer: GENERIC; Manufacturer1 Part Number: NRC06F5101TRF; Manufacturer1 Datasheet: \\cern.ch\dfs\Applications\Altium\Datasheets\R0603_NIC_NRC.pdf; Value: 5k1; Power: 0.1W; TC: ±100ppm/°C; Table: Resistors SMD; Part Number: R0603_5K1_1%_0.1W_100PPM; Component Kind: Standard; Component Type: Standard; Designator: Resistor - 1%; Library Reference: Resistor - 1%; Pin Count: 2; Status: Preferred; Tolerance: ±1%; Manufacturer Part Number: R0603_5K1_1%_0.1W_100PPM; Case: 0603; Mounted: Yes; Socket: No; SMD: Yes; Manufacturer1 Example: NIC COMPONENT; Manufacturer1 ComponentHeight: 0.55mm; HelpURL: \\cern.ch\dfs\Applications\Altium\Datasheets\R0603_NIC_NRC.pdf; Author: CERN DEM JLC; CreateDate: 2007-12-03; LatestRevisionDate: 2008-03-13
R60 R61 R83 R84 = R0603_200R_0.1%_0.063W_10PPM: Resistor - 0.1%; Part Description: Thin Film Chip Resistor; Manufacturer: GENERIC; Manufacturer1 Part Number: RN73C1J200RBTDF; Manufacturer1 Datasheet: \\cern.ch\dfs\Applications\Altium\Datasheets\R0603_Tyco_RN73.pdf; Power: 0.063W; TC: ±10ppm; Table: Resistors SMD; Part Number: R0603_200R_0.1%_0.063W_10PPM; Component Kind: Standard; Component Type: Standard; Designator: Resistor - 0.1%; Library Reference: Resistor - 0.1%; Pin Count: 2; Value: 200; Status: Not recommended; Tolerance: ±0.1%; Manufacturer Part Number: R0603_200R_0.1%_0.063W_10PPM; Case: 0603; Mounted: Yes; Socket: No; SMD: Yes; Manufacturer1 Example: TYCO HOLSWORTHY; Manufacturer1 ComponentHeight: 0.5mm; HelpURL: \\cern.ch\dfs\Applications\Altium\Datasheets\R0603_Tyco_RN73.pdf; Author: CERN DEM JLC; CreateDate: 2007-12-03; LatestRevisionDate: 2008-03-13
R63 = R0603_4K12_0.1%_0.063W_10PPM: Resistor - 0.1%; Part Description: Thin Film Chip Resistor; Manufacturer: GENERIC; Manufacturer1 Part Number: RN73C1J4K12BTDF; Manufacturer1 Datasheet: \\cern.ch\dfs\Applications\Altium\Datasheets\R0603_Tyco_RN73.pdf; Value: 4k12; Power: 0.063W; TC: ±10ppm; Table: Resistors SMD; Part Number: R0603_4K12_0.1%_0.063W_10PPM; Component Kind: Standard; Component Type: Standard; Designator: Resistor - 0.1%; Library Reference: Resistor - 0.1%; Pin Count: 2; Status: Not recommended; Tolerance: ±0.1%; Manufacturer Part Number: R0603_4K12_0.1%_0.063W_10PPM; Case: 0603; Mounted: Yes; Socket: No; SMD: Yes; Manufacturer1 Example: TYCO HOLSWORTHY; Manufacturer1 ComponentHeight: 0.5mm; HelpURL: \\cern.ch\dfs\Applications\Altium\Datasheets\R0603_Tyco_RN73.pdf; Author: CERN DEM JLC; CreateDate: 2007-12-03; LatestRevisionDate: 2008-03-13
R66 = R0603_820R_1%_0.1W_100PPM: Resistor - 1%; Part Description: General Purpose Thick Film Chip Resistor; Manufacturer: GENERIC; Manufacturer1 Part Number: NRC06F8200TRF; Manufacturer1 Datasheet: \\cern.ch\dfs\Applications\Altium\Datasheets\R0603_NIC_NRC.pdf; Power: 0.1W; TC: ±100ppm/°C; Table: Resistors SMD; Part Number: R0603_820R_1%_0.1W_100PPM; Component Kind: Standard; Component Type: Standard; Designator: Resistor - 1%; Library Reference: Resistor - 1%; Pin Count: 2; Value: 820; Status: Preferred; Tolerance: ±1%; Manufacturer Part Number: R0603_820R_1%_0.1W_100PPM; Case: 0603; Mounted: Yes; Socket: No; SMD: Yes; Manufacturer1 Example: NIC COMPONENT; Manufacturer1 ComponentHeight: 0.55mm; HelpURL: \\cern.ch\dfs\Applications\Altium\Datasheets\R0603_NIC_NRC.pdf; Author: CERN DEM JLC; CreateDate: 2007-12-03; LatestRevisionDate: 2008-03-13
R67 = R0603_390R_1%_0.1W_100PPM: Resistor - 1%; Part Description: General Purpose Thick Film Chip Resistor; Manufacturer: GENERIC; Manufacturer1 Part Number: NRC06F3900TRF; Manufacturer1 Datasheet: \\cern.ch\dfs\Applications\Altium\Datasheets\R0603_NIC_NRC.pdf; Power: 0.1W; TC: ±100ppm/°C; Table: Resistors SMD; Part Number: R0603_390R_1%_0.1W_100PPM; Component Kind: Standard; Component Type: Standard; Designator: Resistor - 1%; Library Reference: Resistor - 1%; Pin Count: 2; Value: 390; Status: Preferred; Tolerance: ±1%; Manufacturer Part Number: R0603_390R_1%_0.1W_100PPM; Case: 0603; Mounted: Yes; Socket: No; SMD: Yes; Manufacturer1 Example: NIC COMPONENT; Manufacturer1 ComponentHeight: 0.55mm; HelpURL: \\cern.ch\dfs\Applications\Altium\Datasheets\R0603_NIC_NRC.pdf; Author: CERN DEM JLC; CreateDate: 2007-12-03; LatestRevisionDate: 2008-03-13
R95 = R0603_0R_JUMPER: Resistor - 1%; Part Description: 1A (0.05R Max DC Resistance) Zero Ohm Jumper; Manufacturer: GENERIC; Manufacturer1 Part Number: NRC06Z0; Manufacturer1 Datasheet: \\cern.ch\dfs\Applications\Altium\Datasheets\R0603_NIC_NRC.pdf; Table: Resistors SMD; Part Number: R0603_0R_JUMPER; Component Kind: Standard; Component Type: Standard; Designator: Resistor - 1%; Library Reference: Resistor - 1%; Pin Count: 2; Value: 0; Status: Preferred; Manufacturer Part Number: R0603_0R_JUMPER; Case: 0603; Mounted: Yes; Socket: No; SMD: Yes; Manufacturer1 Example: NIC COMPONENT; Manufacturer1 ComponentHeight: 0.55mm; HelpURL: \\cern.ch\dfs\Applications\Altium\Datasheets\R0603_NIC_NRC.pdf; Author: CERN DEM JLC; CreateDate: 2007-12-03; LatestRevisionDate: 2008-03-13
SJ1-SJ4 SJ7 = SOLDER_JOINT_NORM_OPEN
SJ5 SJ6 = SOLDER_JOINT_NORM_CLOSED